# Altium schematic sheet Controle_placa_potencia.SchDoc: CONTROLADORA MAIS PIPOCA - REVISÃO EMC
size A3; DocumentNumber: 5; SheetNumber: 5; SheetTotal: 17
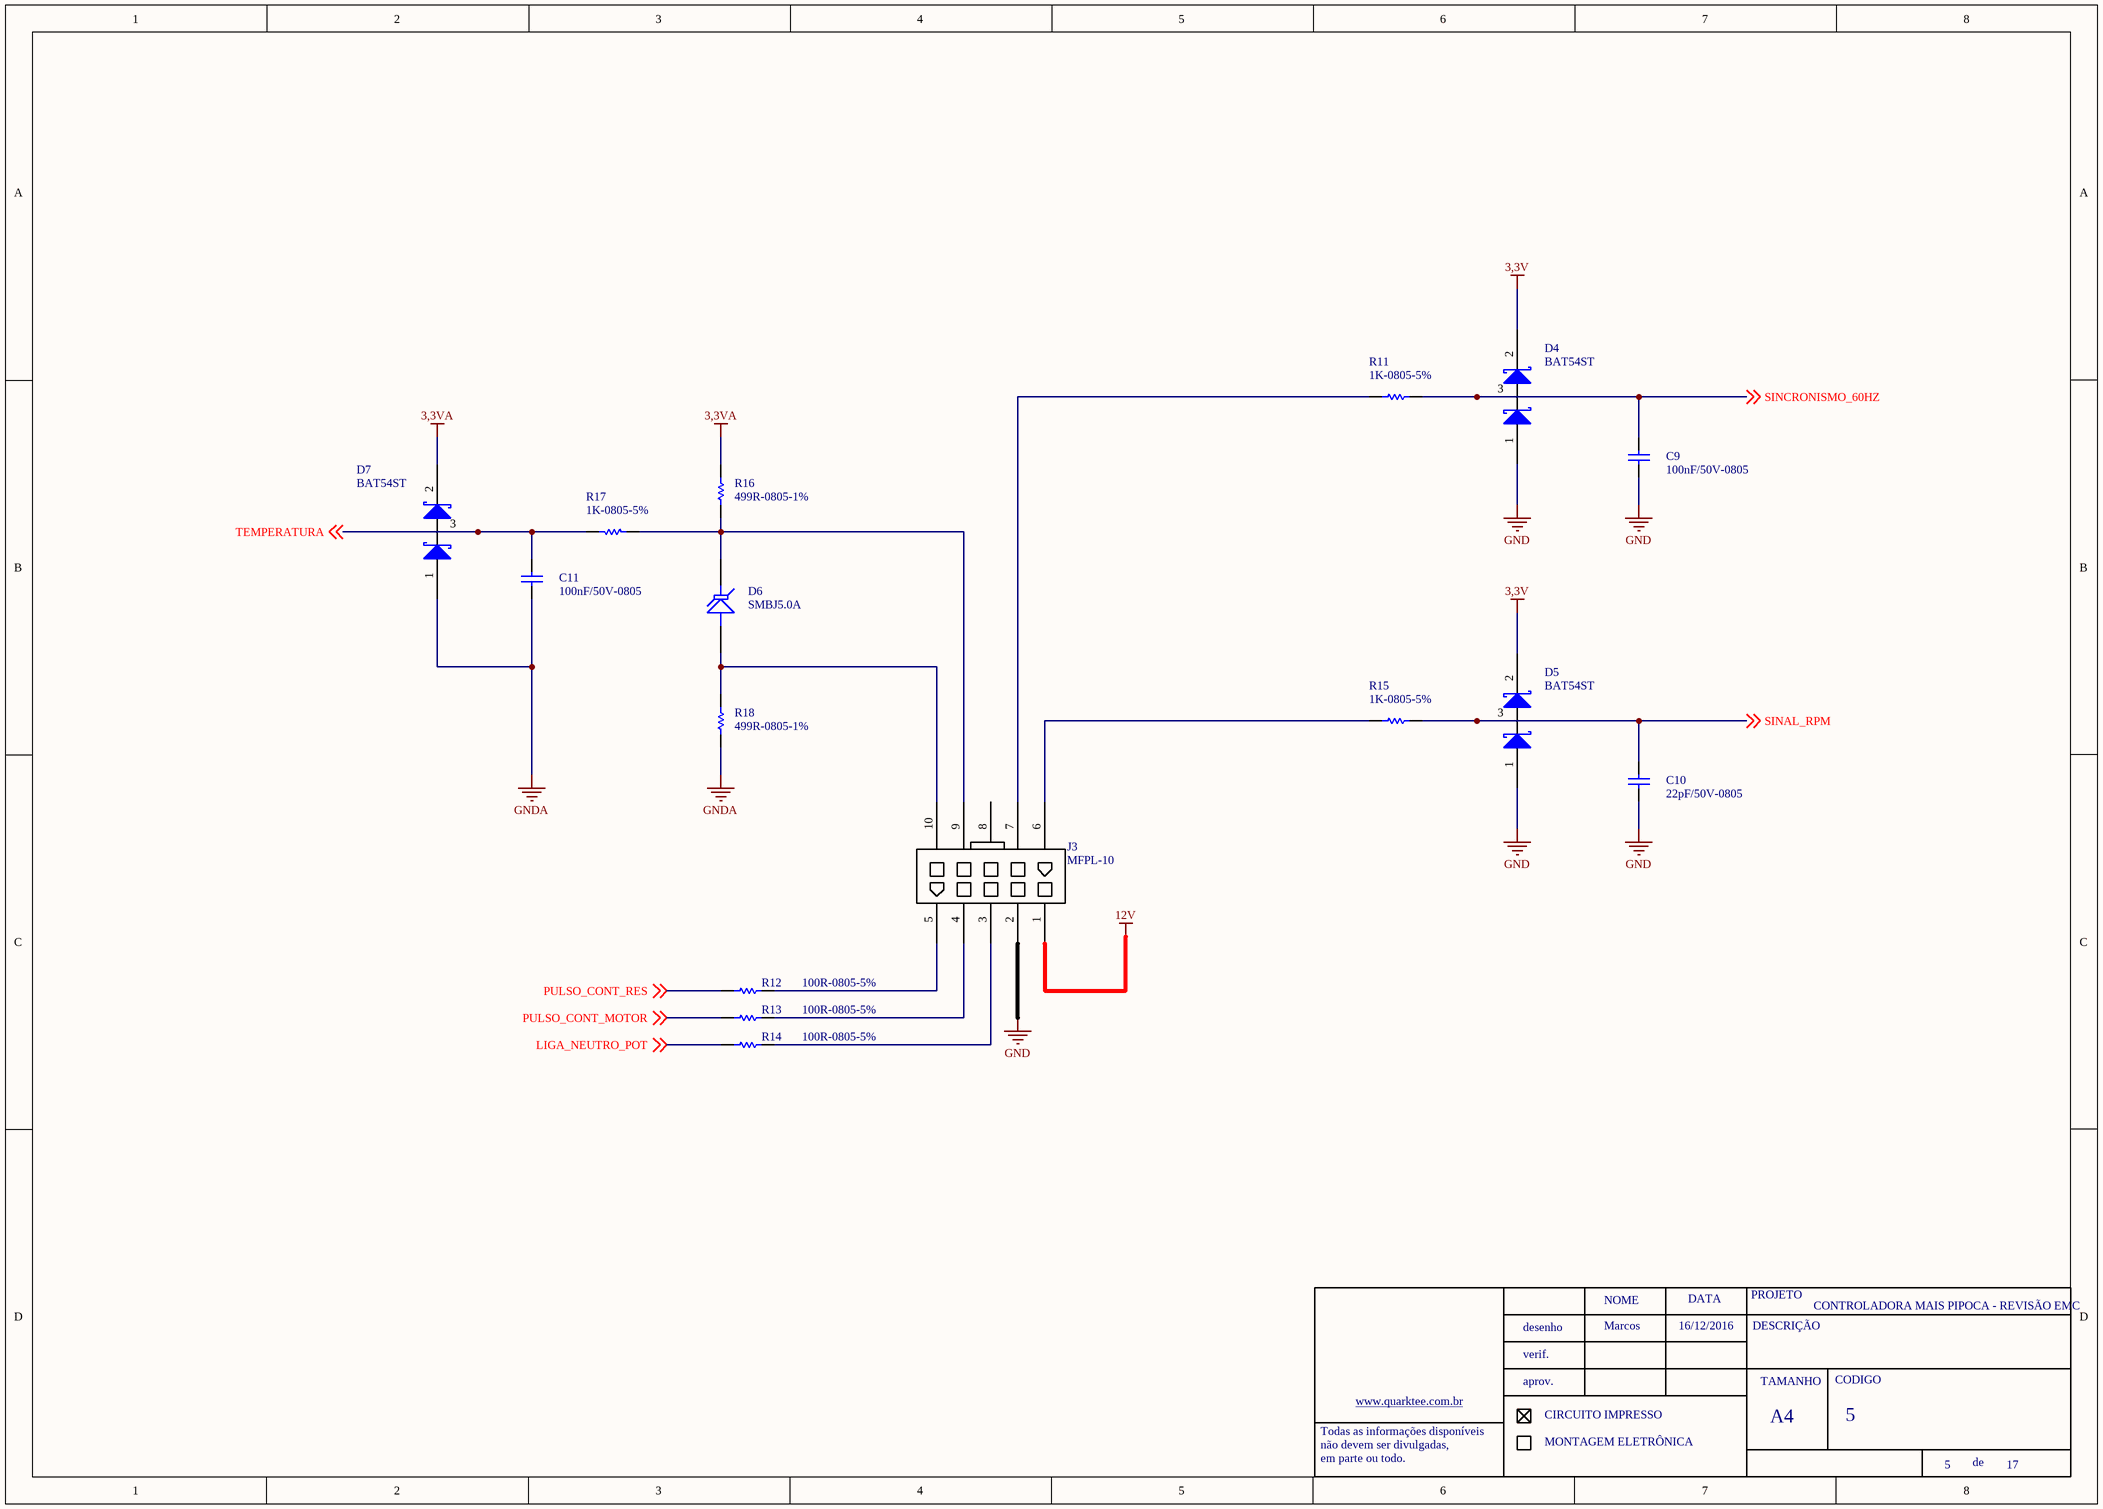
[diagram p0: Controle_placa_potencia.SchDoc]

## Parts
C9  100nF/50V-0805  [0805-REVISADO ONDA]
C10  22pF/50V-0805  [0805-REVISADO ONDA]
C11  100nF/50V-0805  [0805-REVISADO ONDA]
D4  BAT54ST  [SOT23 - REVISADO ONDA]
D5  BAT54ST  [SOT23 - REVISADO ONDA]
D6  SMBJ5.0A  [SMA DIODES]
D7  BAT54ST  [SOT23 - REVISADO ONDA]
J3  MFPL-10
R11  1K-0805-5%  [0805-REVISADO ONDA]
R12  100R-0805-5%  [0805-REVISADO ONDA]
R13  100R-0805-5%  [0805-REVISADO ONDA]
R14  100R-0805-5%  [0805-REVISADO ONDA]
R15  1K-0805-5%  [0805-REVISADO ONDA]
R16  499R-0805-1%  [0805-REVISADO ONDA]
R17  1K-0805-5%  [0805-REVISADO ONDA]
R18  499R-0805-1%  [0805-REVISADO ONDA]

## Nets
3,3V: D4.2 D5.2
3,3VA: D7.2 R16.2
12V: J3.1
GND: C9.2 C10.2 D4.1 D5.1 J3.2
GNDA: C11.1 D7.1 R18.1
LIGA_NEUTRO_POT: R14.1 ; off-sheet LIGA_NEUTRO_POT
PULSO_CONT_MOTOR: R13.1 ; off-sheet PULSO_CONT_MOTOR
PULSO_CONT_RES: R12.2 ; off-sheet PULSO_CONT_RES
SINAL_RPM: C10.1 D5.3 R15.2 ; off-sheet SINAL_RPM
SINCRONISMO_60HZ: C9.1 D4.3 R11.2 ; off-sheet SINCRONISMO_60HZ
TEMPERATURA: C11.2 D7.3 R17.2 ; off-sheet TEMPERATURA
NetD6_1: D6.1(A) J3.10 R18.2
NetD6_2: D6.2(K) J3.9 R16.1 R17.1
NetJ3_3: J3.3 R14.2
NetJ3_4: J3.4 R13.2
NetJ3_5: J3.5 R12.1
NetJ3_6: J3.6 R15.1
NetJ3_7: J3.7 R11.1

Not connected (* = marked no-connect by the designer): J3 8

## Notes on the sheet
- Marcos
- 16/12/2016
- NOME
- DATA
- PROJETO
- DESCRIÇÃO
- desenho
- verif.
- aprov.
- TAMANHO
- CODIGO
- Todas as informações disponíveis
- não devem ser divulgadas,
- em parte ou todo.
- www.quarktee.com.br
- CIRCUITO IMPRESSO
- MONTAGEM ELETRÔNICA
- A4
- de

## Library data of the parts
C9 C11 = 100nF/50-0805-NPO: ERP: 104.11.005
C10 = 100nF/50-0805-NPO: 100nF/50V-0805; ERP: 104.11.005
R16 R18 = 10K-0805-5%: ERP: 102.11.054
D6 = SMBJ5.0A: ERP: 128.02.002
R11 R15 R17 = 1K-0805-5%: ERP: 102.11.042
R12-R14 = 100R-0805-5%: ERP: 102.11.031